# EAGLE design tinyRF (EAGLE 6.4)
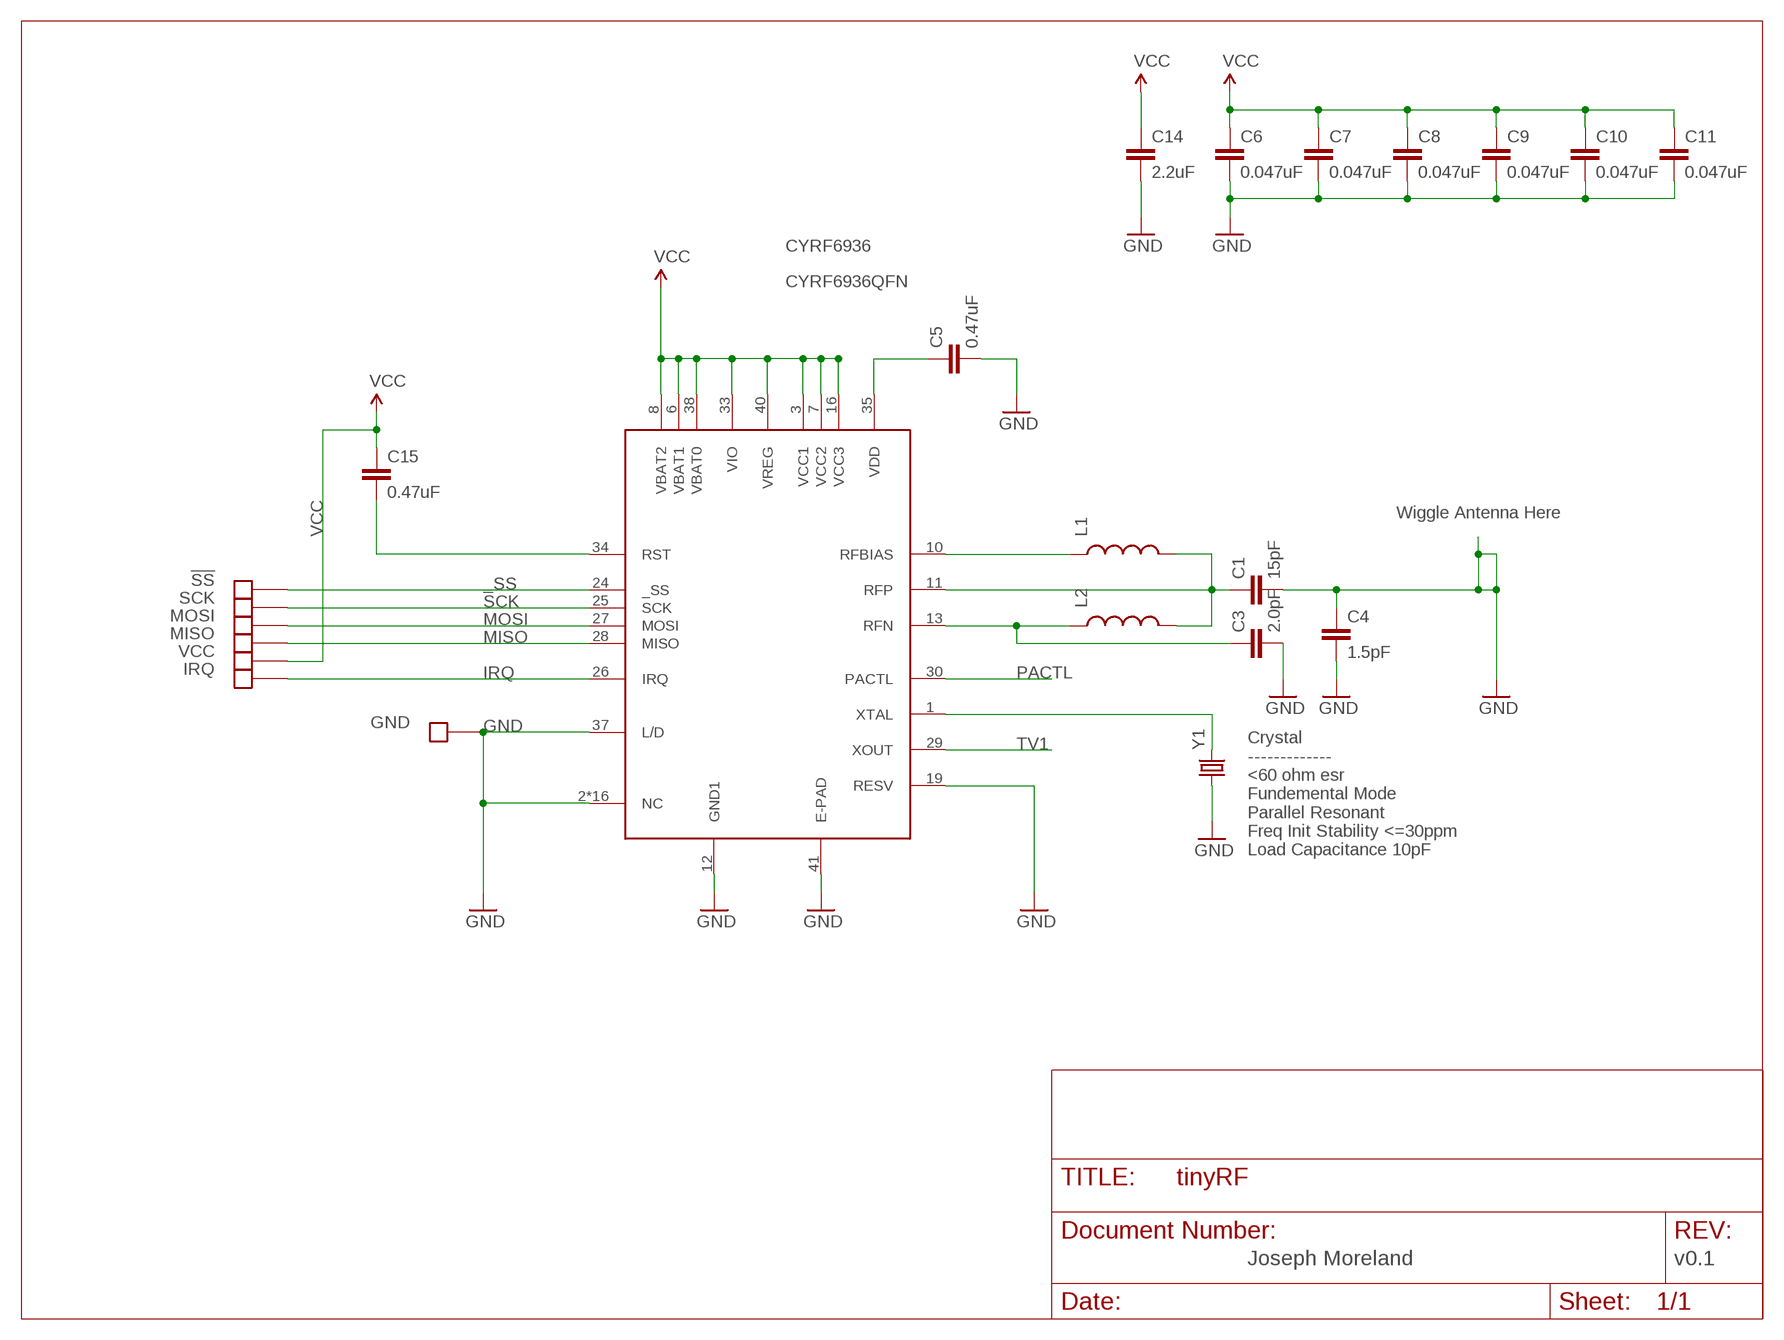
[diagram p0: schematic, sheet 1]

## Parts
!SS  SOLDER_PADTH  [1X1_50MIL]
C1  15pF  CAP0402-CAP  [0402-CAP]
C3  2.0pF  CAP0402-CAP  [0402-CAP]
C4  1.5pF  CAP0402-CAP  [0402-CAP]
C5  0.47uF  CAP0402-CAP  [0402-CAP]
C6  0.047uF  CAP0402-CAP  [0402-CAP]
C7  0.047uF  CAP0402-CAP  [0402-CAP]
C8  0.047uF  CAP0402-CAP  [0402-CAP]
C9  0.047uF  CAP0402-CAP  [0402-CAP]
C10  0.047uF  CAP0402-CAP  [0402-CAP]
C11  0.047uF  CAP0402-CAP  [0402-CAP]
C14  2.2uF  CAP0805  [0805]
C15  0.47uF  CAP0402-CAP  [0402-CAP]
CYRF6936  CYRF6936QFN  [QFN50P600X600X90-41N]
GND  SOLDER_PADTH  [1X1_50MIL]
IRQ  SOLDER_PADTH  [1X1_50MIL]
L1  INDUCTOR0603  [0603]
L2  INDUCTOR0402  [C0402]
MISO  SOLDER_PADTH  [1X1_50MIL]
MOSI  SOLDER_PADTH  [1X1_50MIL]
SCK  SOLDER_PADTH  [1X1_50MIL]
VCC  SOLDER_PADTH  [1X1_50MIL]
Y1  CRYSTAL5X3  [CRYSTAL-SMD-5X3]

## Nets
_SS: !SS.1(NET) CYRF6936.24(_SS)
GND: C1.2 C3.2 C4.1 C4.2 C5.2 C6.2 C7.2 C8.2 C9.2 C10.2 C11.2 C14.2 CYRF6936.2(NC) CYRF6936.4(NC) CYRF6936.5(NC) CYRF6936.9(NC) CYRF6936.12(GND1) CYRF6936.14(NC) CYRF6936.15(NC) CYRF6936.17(NC) CYRF6936.18(NC) CYRF6936.19(RESV) CYRF6936.20(NC) CYRF6936.21(NC) CYRF6936.22(NC) CYRF6936.23(NC) CYRF6936.31(NC) CYRF6936.32(NC) CYRF6936.36(NC) CYRF6936.37(L/D) CYRF6936.39(NC) CYRF6936.41(E-PAD) GND.1(NET) Y1.1
IRQ: CYRF6936.26(IRQ) IRQ.1(NET)
MISO: CYRF6936.28(MISO) MISO.1(NET)
MOSI: CYRF6936.27(MOSI) MOSI.1(NET)
N$2: CYRF6936.1(XTAL) Y1.3
PACTL: CYRF6936.30(PACTL)
RFBIAS: CYRF6936.10(RFBIAS) L1.1
RFN: C3.1 CYRF6936.13(RFN) L2.1
RFP: C1.1 CYRF6936.11(RFP) L1.2 L2.2
RST: C15.2 CYRF6936.34(RST)
SCK: CYRF6936.25(SCK) SCK.1(NET)
TV1: CYRF6936.29(XOUT)
VCC: C6.1 C7.1 C8.1 C9.1 C10.1 C11.1 C14.1 C15.1 CYRF6936.3(VCC1) CYRF6936.6(VBAT1) CYRF6936.7(VCC2) CYRF6936.8(VBAT2) CYRF6936.16(VCC3) CYRF6936.33(VIO) CYRF6936.38(VBAT0) CYRF6936.40(VREG) VCC.1(NET)
VDD: C5.1 CYRF6936.35(VDD)

## Notes on the sheet
- Wiggle Antenna Here
- Crystal
  -------------
  <60 ohm esr
  Fundemental Mode
  Parallel Resonant
  Freq Init Stability <=30ppm
  Load Capacitance 10pF
- Joseph Moreland | v0.1

## Library data of the parts
!SS GND IRQ MISO MOSI SCK VCC = JCM-Connectors:SOLDER_PAD
C1 = JCM-Capacitors:CAP: Capacitor Standard 0603 ceramic capacitor, and 0.1" leaded capacitor.; PARTNO: C0402C150J5GACTU; VOLT: 50
C3 = JCM-Capacitors:CAP: Capacitor Standard 0603 ceramic capacitor, and 0.1" leaded capacitor.; PARTNO: C0402C209C5GACTU; VOLT: 50
C4 = JCM-Capacitors:CAP: Capacitor Standard 0603 ceramic capacitor, and 0.1" leaded capacitor.; PARTNO: C0402C159B5GACTU; VOLT: 50
C5 C15 = JCM-Capacitors:CAP: Capacitor Standard 0603 ceramic capacitor, and 0.1" leaded capacitor.; PARTNO: GRM155R60J474KE19D; VOLT: 6.3
C6-C11 = JCM-Capacitors:CAP: Capacitor Standard 0603 ceramic capacitor, and 0.1" leaded capacitor.; PARTNO: 0402YD473KAT2A
C14 = JCM-Capacitors:CAP: Capacitor Standard 0603 ceramic capacitor, and 0.1" leaded capacitor.; PARTNO: GRM21BR71A225KA01L
CYRF6936 = JCM-IC:CYRF6936; PARTNO: CYRF6936B-40LTXC
L1 = SparkFun-Passives:INDUCTOR: Inductors Basic Inductor/Choke - 0603 and 1206. Footprints are not proven and vary greatly between part numbers.; PARTNO: ELJ-RE22NGFA
L2 = SparkFun-Passives:INDUCTOR: Inductors Basic Inductor/Choke - 0603 and 1206. Footprints are not proven and vary greatly between part numbers.; PARTNO: ELJ-RF1N8DFB
Y1 = SparkFun-FreqCtrl:CRYSTAL: Various standard crystals. Proven footprints. Spark Fun Electronics SKU : COM-00534; PARTNO: 7B-12.000MEEQ-T

## Board
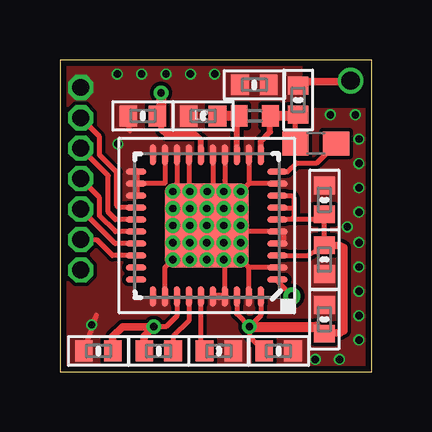
[diagram p1: board, top side]
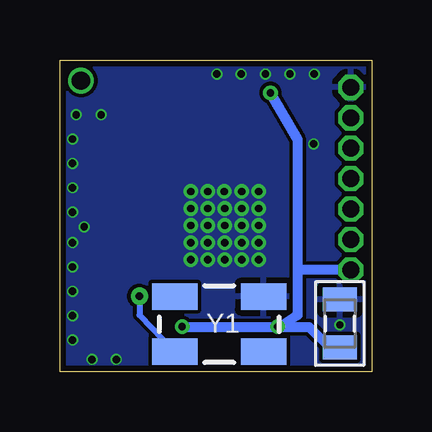
[diagram p2: board, bottom side, seen from below]

Size 13 x 13 mm. Coordinates in mm from the lower left corner, seen from the top.
Outline: 0,13 0,0 13,0 13,13 0,13
Copper layers (1*16): Top 0.035mm / dielectric 1.5mm / Bottom 0.035mm
Design rules "Fusion_eagle_rule_v1.1-JCM-restring *": minimum track width 6mil, minimum drill 12mil, track to track 6mil, track to pad 6mil, pad to pad 6mil, via to via 6mil, smd to smd 0mil, copper to edge 10mil, drill to drill 10mil, minimum pad ring 6mil, minimum via ring 2mil, stop-mask expansion 2mil, vias tented up to drill 100mil, thermal gap 10mil
tRestrict: area 10.1,11 to 13.1,13.5

### Footprints (pad centres in the part's own frame; a part is rotated, then mirrored left to right if it is on the bottom)
1X1_50MIL = drill 0.7 pad 1.016 octagon: 1 0,0
0402-CAP = smd 0.74 x 0.87: 1 -0.6,0; 2 0.6,0
0805 = smd 1 x 1.4: 1 -1,0; 2 1,0
QFN50P600X600X90-41N = smd 0.25 x 0.86: 1 -2.25,-2.95; 2 -1.75,-2.95; 3 -1.25,-2.95; 4 -0.75,-2.95; 5 -0.25,-2.95; 6 0.25,-2.95; 7 0.75,-2.95; 8 1.25,-2.95; 9 1.75,-2.95; 10 2.25,-2.95; 21 2.25,2.95; 22 1.75,2.95; 23 1.25,2.95; 24 0.75,2.95; 25 0.25,2.95; 26 -0.25,2.95; 27 -0.75,2.95; 28 -1.25,2.95; 29 -1.75,2.95; 30 -2.25,2.95 | smd 0.86 x 0.25: 11 2.95,-2.25; 12 2.95,-1.75; 13 2.95,-1.25; 14 2.95,-0.75; 15 2.95,-0.25; 16 2.95,0.25; 17 2.95,0.75; 18 2.95,1.25; 19 2.95,1.75; 20 2.95,2.25; 31 -2.95,2.25; 32 -2.95,1.75; 33 -2.95,1.25; 34 -2.95,0.75; 35 -2.95,0.25; 36 -2.95,-0.25; 37 -2.95,-0.75; 38 -2.95,-1.25; 39 -2.95,-1.75; 40 -2.95,-2.25 | smd 3.5 x 3.5: 41 0,0
0603 = smd 1.1 x 1: 1 -0.85,0; 2 0.85,0
C0402 = smd 0.7 x 0.9: 1 -0.65,0; 2 0.65,0
CRYSTAL-SMD-5X3 = smd 1.9 x 1.1: 1 -1.85,-1.15; 2 1.85,-1.15; 3 1.85,1.15; 4 -1.85,1.15

### Placement (x,y rotation side)
!SS  0.87,10.59 0 top
C1  9.94,11.32 90 top
C3  5.97,10.66 180 top
C4  8.11,11.96 180 top
C5  6.63,0.86 0 top
C6  3.46,10.66 180 top
C7  11.03,2.18 90 top
C8  1.6,0.86 180 top
C9  9.12,0.86 0 top
C10  11.03,4.67 270 top
C11  11.03,7.16 90 top
C14  1.32,2 90 bottom
C15  4.12,0.86 0 top
CYRF6936  6.13,6.09 90 top
GND  0.87,11.86 0 top
IRQ  0.87,8.05 0 top
L1  10.67,9.52 180 top
L2  8.13,10.66 0 top
MISO  0.87,5.51 0 top
MOSI  0.87,6.78 0 top
SCK  0.87,9.32 0 top
VCC  0.87,4.24 0 bottom
Y1  6.35,1.98 180 bottom

### Tracks (layer width: path | path; a pad name or v marks a point on that pad's centre or on a via)
_SS
  Top 0.203: CYRF6936.24 2.45,6.84 2.37,6.93 2.37,8.33 1.65,9.04 1.65,9.8 !SS.1
GND  (via drill 0.3, 0.3 pad 0.61)
  Top 0.203: CYRF6936.17 5.38,6.09 | 9.1,5.84 7.83,5.84 6.38,7.29 CYRF6936.15 | 7.75,5.36 7.78,6.09 | CYRF6936.2 7.88,4.34 | CYRF6936.18 4.88,7.84 | CYRF6936.19 4.38,7.84 CYRF6936.22 3.15,7.87 | CYRF6936.9 7.88,7.84 | CYRF6936.12 7.88,7.85 v7.55,7.51 | CYRF6936.14 6.88,7.98 v6.84,7.51 | CYRF6936.37 6.88,4.63 v6.84,4.67 | 2.91,10.03 C6.2 | C8.2 1.53,2.36 v1.32,1.95 | 7.75,5.28 7.65,5.28 v7.55,5.38 | CYRF6936.39 7.88,4.34 | 7.88,4.34 v7.55,4.67 | CYRF6936.32 4.38,4.34 v4.7,4.67 | 9.1,5.33 9.35,5.33 9.35,5.84 9.1,5.84
  Top 0.254: 5.38,5.58 5.38,6.09 | 9.11,5.85 CYRF6936.5 9.1,5.84 | 7.78,6.09 CYRF6936.41 | CYRF6936.39 7.88,3.12 | 7.75,4.49 7.75,5.28
  Top 0.305: CYRF6936.36 CYRF6936.37 | CYRF6936.21 CYRF6936.23 | 9.96,11.93 10.11,12.09 12.09,12.09
  Top 0.406: 5.38,6.09 CYRF6936.41
  other vias: 6.15,7.51 5.41,7.51 4.7,7.51 7.55,6.8 6.84,6.8 6.13,6.8 5.41,6.8 4.7,6.8 7.55,6.09 6.84,6.09 6.13,6.09 5.41,6.09 4.7,6.09 6.84,5.38 6.13,5.38 5.41,5.38 4.7,5.38 6.13,4.67 5.41,4.67 4.42,12.42 2.42,9.49 6.46,12.42 10.65,0.5 5.44,12.42 11.99,6.04 11.28,10.71 12.32,10.71 12.48,9.7 12.48,8.68 12.48,7.67 3.41,12.42 2.39,12.42 12.48,6.65 12.48,5.38 12.48,4.36 12.48,3.35 12.48,2.33 12.48,1.32 11.66,0.5
  pour Bottom: -0.33,-0.45 13.17,-0.45 13.17,13.55 -0.33,13.55
  pour Top (rank 2, no thermals): -0.33,-0.45 13.17,-0.45 13.17,13.55 -0.33,13.55
IRQ
  Top 0.203: CYRF6936.26 3.15,5.84 2.32,5.84 1.65,6.5 1.65,7.26 IRQ.1
MISO
  Top 0.203: CYRF6936.28 2.19,4.84 1.55,5.48 0.89,5.48 MISO.1
MOSI
  Top 0.203: 3.14,5.33 CYRF6936.27 2.3,5.34 MOSI.1
N$1  (via drill 0.76 pad 1.07)
  other vias: 12.12,12.14
N$2  (via drill 0.3 pad 0.71)
  Top 0.203: CYRF6936.1 9.08,3.75 v9.68,3.15
  Bottom 0.254: v9.68,3.15 9.68,2.36 Y1.3
RFBIAS
  Top 0.203: CYRF6936.10 9.49,8.34 9.86,8.71 10.71,8.71 L1.1
RFN
  Top 0.152: 7.38,10.56 L2.1
  Top 0.254: CYRF6936.13 7.38,10.56
  Top 0.406: L2.1 C3.1
RFP
  Top 0.152: 8.77,10.65 L2.2
  Top 0.203: 9.82,10.66 C1.1 9.82,10.48 L1.2
  Top 0.254: CYRF6936.11 8.38,9.61 8.77,10 8.77,10.65
  Top 0.406: 9.82,10.66 L2.2
RST
  Top 0.203: CYRF6936.34 5.38,2.12 4.73,1.47 C15.2
SCK
  Top 0.203: CYRF6936.25 2.32,6.34 2.01,6.65 2.01,8.17 SCK.1
VCC  (via drill 0.3 pad 0.61)
  Top 0.152: 4.04,10.89 C6.1 4.25,10.63
  Top 0.203: 5.88,9.67 5.67,9.88 | CYRF6936.7 9.11,6.83 9.73,6.83 9.76,6.85 | 4.22,10.67 C6.1 | CYRF6936.38 7.38,2.4 v7.9,1.88 | CYRF6936.40 8.38,2.35 v7.9,1.88 | v3.92,1.88 4.42,1.88 4.88,2.33 CYRF6936.33 | CYRF6936.3 10.35,4.84 C10.1 C11.1 10.61,6.34 CYRF6936.6 9.66,6.35 9.76,6.45 9.76,6.85 | CYRF6936.8 9.68,7.34 9.76,7.26 9.76,6.85 | v7.9,1.88 7.9,1.48 C9.1
  Top 0.254: CYRF6936.16 5.88,9.67 | 5.67,9.88 4.45,9.88 4.25,10.08 4.25,10.63
  Top 0.305: C8.1 2.2,1.46 2.62,1.88 v3.92,1.88 3.52,1.48 C15.1 | C10.1 11.67,5.27 11.84,5.18 11.84,1.7 11.69,1.62 11.07,1.62 C7.1
  Top 0.406: v4.22,11.63 4.22,10.67 | v7.9,1.88 10.68,1.88 C7.1
  Bottom 0.203: 3.05,4.24 3.08,4.21
  Bottom 0.254: 3.89,1.85 v3.92,1.88
  Bottom 0.406: v7.9,1.88 v3.92,1.88 3.81,1.88 3.08,2.36 3.08,4.21 3.08,9.67 v4.22,11.63 | 3.89,1.85 2.59,1.85 1.75,1 C14.1 | VCC.1 3.05,4.24
VDD
  Top 0.203: CYRF6936.35 5.87,3.11 5.87,1.02 C5.1

### Text on the board
bDocu: CYRF6936-BoB / v0.1 / 18 Apr 2013